# EAGLE design Sensor_Board (EAGLE 6.5.0)
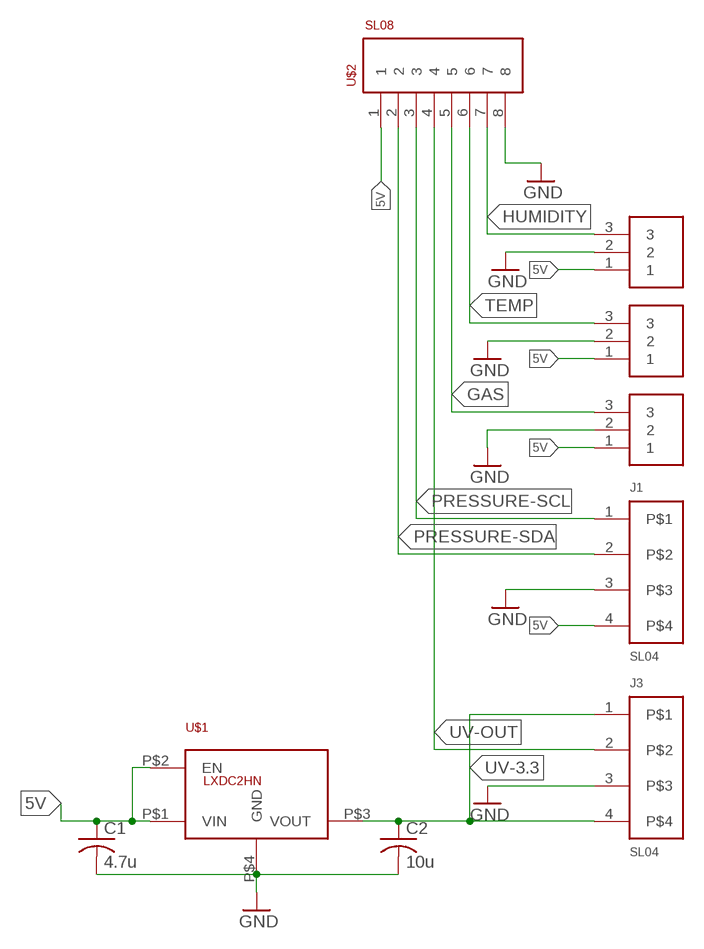
[diagram p0: schematic, sheet 1]

## Parts
C1  4.7u  C-USC0805  [C0805]
C2  10u  C-USC0805  [C0805]
J1  SL04  [MOLEX_SL_04_TH]
J2  SL03THROUGH_HOLE  [MOLEX_SL_03_TH]
J3  SL04  [MOLEX_SL_04_TH]
J4  SL03THROUGH_HOLE  [MOLEX_SL_03_TH]
J5  SL03THROUGH_HOLE  [MOLEX_SL_03_TH]
U$1  LXDC2HN  [4-SMD]
U$2  SL08  [MOLEX-70543-0007]

## Nets
5V: C1.1 J1.4 J2.1 J4.1 J5.1 U$1.P$1(VIN) U$1.P$2(EN)
GAS: J5.3 U$2.5
GND: C1.2 C2.2 J1.3 J2.2 J3.3 J4.2 J5.2 U$1.P$4(GND) U$2.8
HUMIDITY: J2.3 U$2.7
PRESSURE-SCL: J1.1 U$2.3
PRESSURE-SDA: J1.2 U$2.2
TEMP: J4.3 U$2.6
UV-3.3: C2.1 J3.1 J3.4 U$1.P$3(VOUT)
UV-OUT: J3.2 U$2.4
Unconnected: U$2.1

## Library data of the parts
C1 C2 = rcl:C-US: CAPACITOR, American symbol
J1 J3 = MRDT-Connectors:SL04
J2 J4 J5 = MRDT-Connectors:SL03: Molex 3-pin SL connector Locking 3 pin connector with standard header spacing. Backward compatible with standard RC servo connectors.; ORIENT: HORIZ; PARTNO: 0705550002
U$1 = MRDT-ICs:LXDC2HN
U$2 = MRDT-Connectors:SL08

## Board
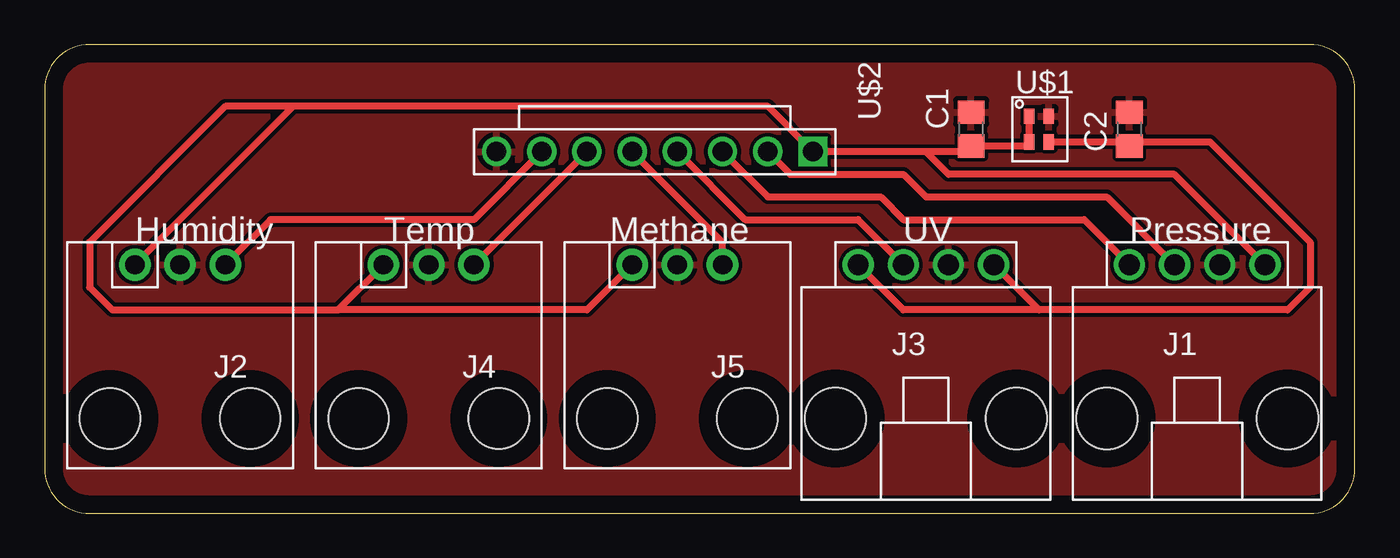
[diagram p1: board, top side]
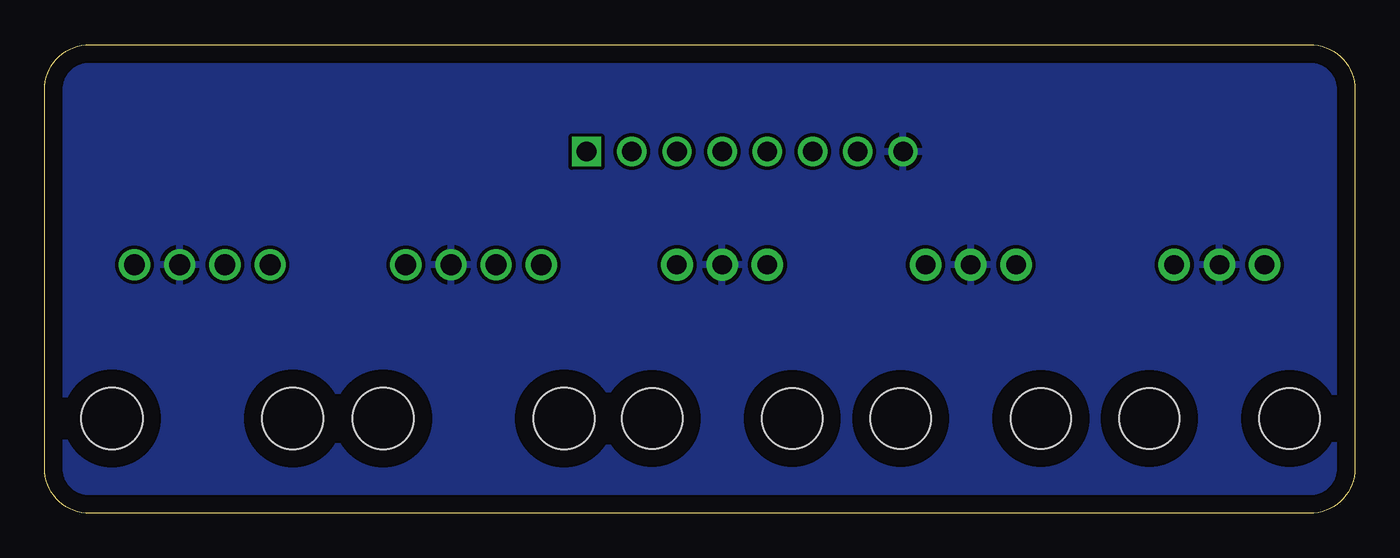
[diagram p2: board, bottom side, seen from below]

Size 73.64 x 26.34 mm. Coordinates in mm from the lower left corner, seen from the top.
Outline: 0,23.8 0,2.54 arc90 2.54,0 71.1,0 arc90 73.64,2.54 73.64,23.8 arc90 71.1,26.34 2.54,26.34 arc90 0,23.8
Copper layers (1*16): Top 0.035mm / dielectric 1.5mm / Bottom 0.035mm
Design rules "default": minimum track width 10mil, minimum drill 24mil, track to track 8mil, track to pad 8mil, pad to pad 8mil, via to via 8mil, smd to smd 8mil, copper to edge 40mil, drill to drill 8mil, minimum pad ring 10mil, minimum via ring 8mil, stop-mask expansion 4mil, vias tented up to drill 0mil, thermal gap 10mil

### Footprints (pad centres in the part's own frame; a part is rotated, then mirrored left to right if it is on the bottom)
C0805 = smd 1.3 x 1.5: 1 -0.95,0; 2 0.95,0
MOLEX_SL_04_TH = drill 1.168: 1 3.81,0; 2 1.27,0; 3 -1.27,0; 4 -3.81,0 | hole 3.454: -5.08,8.636; 5.08,8.636
MOLEX_SL_03_TH = drill 1.092 pad 1.778: 1 2.54,0; 2 0,0; 3 -2.54,0 | hole 3.404: -3.937,8.636; 3.937,8.636
4-SMD = smd 0.85 x 0.6: P$1 0.725,0.55; P$2 -0.725,0.55; P$3 -0.725,-0.55; P$4 0.725,-0.55
MOLEX-70543-0007 = drill 1.1 square: 1 11.43,0 | drill 1.1: 2 8.89,0; 3 6.35,0; 4 3.81,0; 5 1.27,0; 6 -1.27,0; 7 -3.81,0; 8 -6.35,0

### Placement (x,y rotation side)
C1  52.07,21.59 90 top
C2  60.96,21.59 90 top
J1  64.77,13.97 180 top
J2  7.62,13.97 180 top
J3  49.53,13.97 180 top
J4  21.59,13.97 180 top
J5  35.56,13.97 180 top
U$1  55.88,21.59 90 top
U$2  31.75,20.32 0 top

### Tracks (layer width: path | path; a pad name or v marks a point on that pad's centre or on a via)
5V
  Top 0.406: U$1.P$1 U$1.P$2 55.1,20.64 C1.1 52.07,20.32 49.53,20.32 | 49.53,20.32 43.18,20.32 40.64,22.86 13.97,22.86 | 13.97,22.86 10.16,22.86 2.54,15.24 2.54,12.7 3.81,11.43 16.51,11.43 | 16.51,11.43 J4.1 | J5.1 30.48,11.43 16.51,11.43 | J2.1 13.97,22.86 | J1.4 63.5,19.05 50.8,19.05 49.53,20.32
GAS
  Top 0.406: J5.3 38.1,15.24 U$2.5
GND
  pour Bottom: -7.62,30.48 78.74,31.75 77.47,-3.81 -7.62,-5.08
  pour Top: -5.08,29.21 86.36,29.21 83.82,-7.62 -7.62,-6.35
HUMIDITY
  Top 0.406: U$2.7 24.13,16.51 12.7,16.51 J2.3
PRESSURE-SCL
  Top 0.406: U$2.3 40.64,17.78 46.99,17.78 48.26,16.51 58.42,16.51 J1.1
PRESSURE-SDA
  Top 0.406: U$2.2 41.91,19.05 48.26,19.05 49.53,17.78 59.69,17.78 J1.2
TEMP
  Top 0.406: U$2.6 J4.3
UV-3.3
  Top 0.406: C2.1 60.73,20.86 U$1.P$3 65.5,20.86 71.12,15.24 71.12,12.7 69.85,11.43 55.88,11.43 | J3.1 48.26,11.43 55.88,11.43 | J3.4 55.88,11.43
UV-OUT
  Top 0.406: U$2.4 39.37,16.51 45.72,16.51 J3.2

### Text on the board
tPlace: Humidity | Temp | Methane | UV | Pressure